# Altium schematic sheet POWER.SchDoc
size Letter; Organization: UW Robotics; Address1: 200 University Avenue; Address2: Waterloo; Address3: Ontario; Address4: Canada N2L 3G6
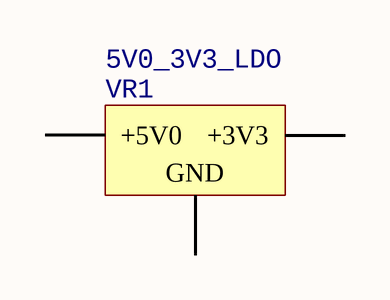
[diagram p0: POWER.SchDoc]

## Parts
VR1  5V0_3V3_LDO  [VOLTAGE_REGULATOR]

## Nets

Not connected (* = marked no-connect by the designer): VR1 1(+5V0) 2(GND) 3(+3V3)

## Notes on the sheet
- Title
- Size:
- Date:
- Letter
- Drawn By:
- Sheet
- of
- File:

## Library data of the parts
VR1 = 5V0_3V3_LDO: IC REG LINEAR 3.3V 1A DPAK; Part Number: NCP1117DT33T5G; Manufacturer: ON Semiconductor; Current Output: 1A